# Altium schematic sheet Connected_Cube.SchDoc: Connected Cube
size A4
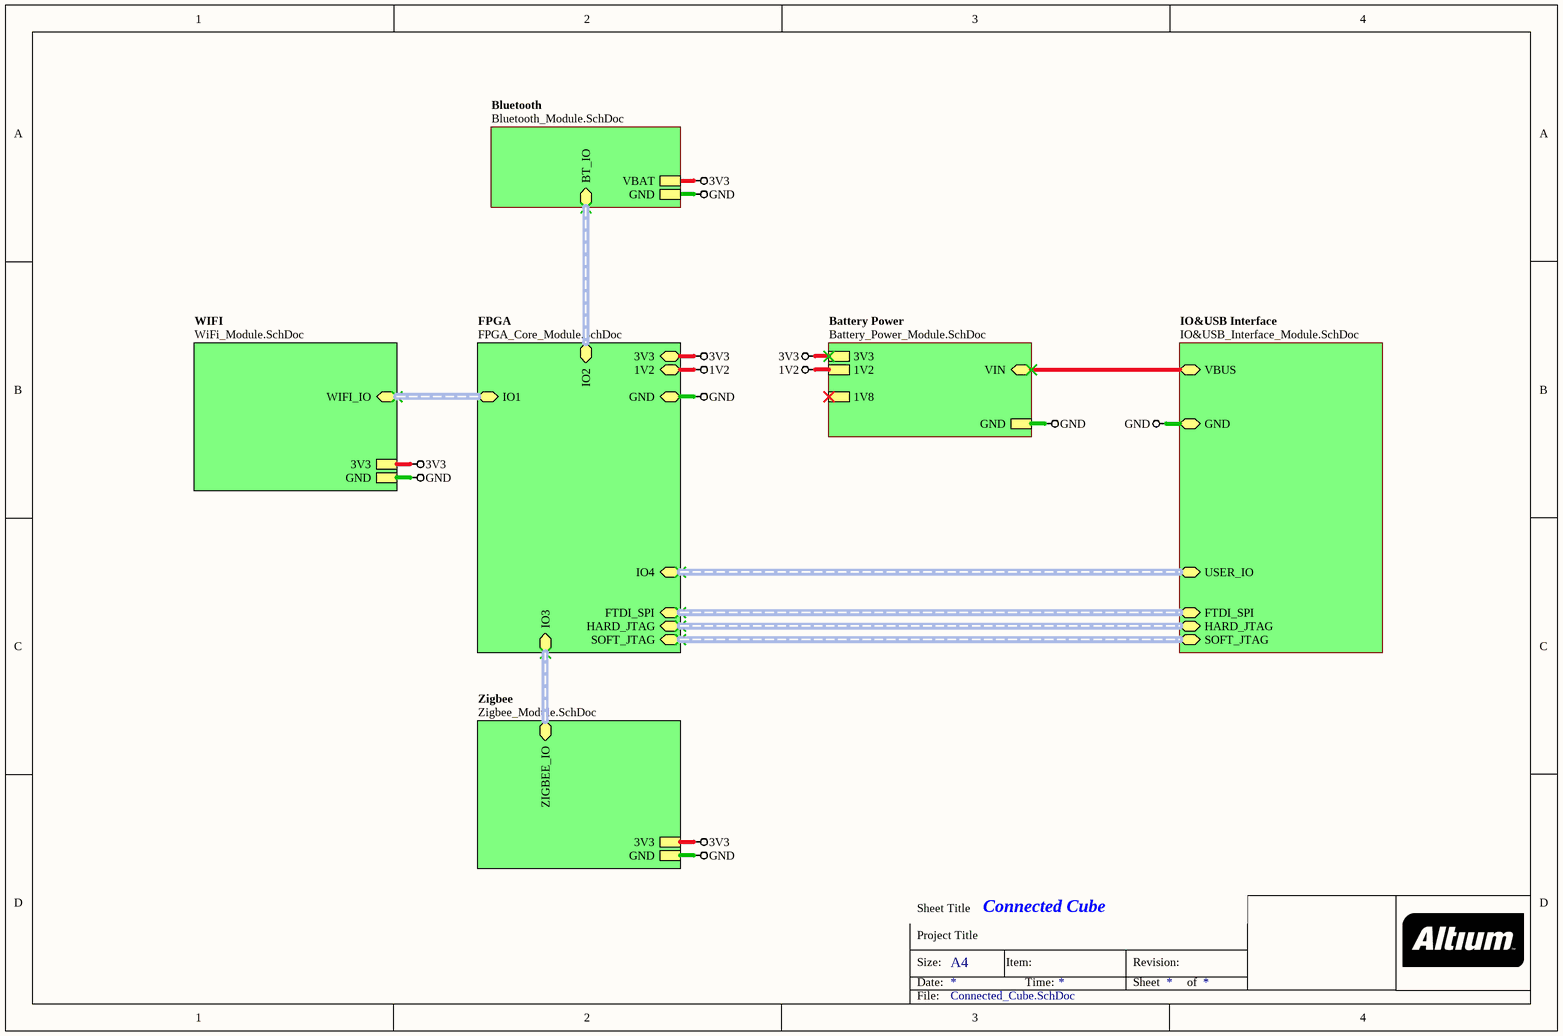
[diagram p0: Connected_Cube.SchDoc]

## Sub-sheets
Battery Power = Battery_Power_Module.SchDoc: 3V3, GND, 1V8, 1V2, VIN
Bluetooth = Bluetooth_Module.SchDoc: VBAT, GND, BT_IO (harness SIG4)
FPGA = FPGA_Core_Module.SchDoc: 3V3, 1V2, GND, FTDI_SPI (harness FTDI_SPI), HARD_JTAG (harness JTAG_A), SOFT_JTAG (harness JTAG_A), IO3 (harness SIG20), IO4 (harness SIG10), IO1 (harness SIG8), IO2 (harness SIG4)
IO&USB Interface = IO&USB_Interface_Module.SchDoc: VBUS, GND, HARD_JTAG (harness JTAG_A), SOFT_JTAG (harness JTAG_A), USER_IO (harness SIG10), FTDI_SPI (harness FTDI_SPI)
WIFI = WiFi_Module.SchDoc: 3V3, GND, WIFI_IO (harness SIG8)
Zigbee = Zigbee_Module.SchDoc: 3V3, GND, ZIGBEE_IO (harness SIG20)

## Nets
1V2: sheet FPGA/1V2, sheet Battery Power/1V2
3V3: sheet FPGA/3V3, sheet Zigbee/3V3, sheet Battery Power/3V3, sheet WIFI/3V3, sheet Bluetooth/VBAT
GND: sheet FPGA/GND, sheet Zigbee/GND, sheet Battery Power/GND, sheet IO&USB Interface/GND, sheet WIFI/GND, sheet Bluetooth/GND
(unnamed): sheet Battery Power/VIN, sheet IO&USB Interface/VBUS

## Buses and harness runs
harness sheet Bluetooth/BT_IO = sheet FPGA/IO2
harness sheet FPGA/FTDI_SPI = sheet IO&USB Interface/FTDI_SPI
harness sheet FPGA/HARD_JTAG = sheet IO&USB Interface/HARD_JTAG
harness sheet FPGA/IO1 = sheet WIFI/WIFI_IO
harness sheet FPGA/IO3 = sheet Zigbee/ZIGBEE_IO
harness sheet FPGA/IO4 = sheet IO&USB Interface/USER_IO
harness sheet FPGA/SOFT_JTAG = sheet IO&USB Interface/SOFT_JTAG

## Notes on the sheet
- Sheet Title
- Project Title
- Size:
- Date:
- A4
- Item:
- Time:
- Revision:
- Sheet
- of
- File: